# Altium schematic sheet MPU-Peripherals.SchDoc
size C
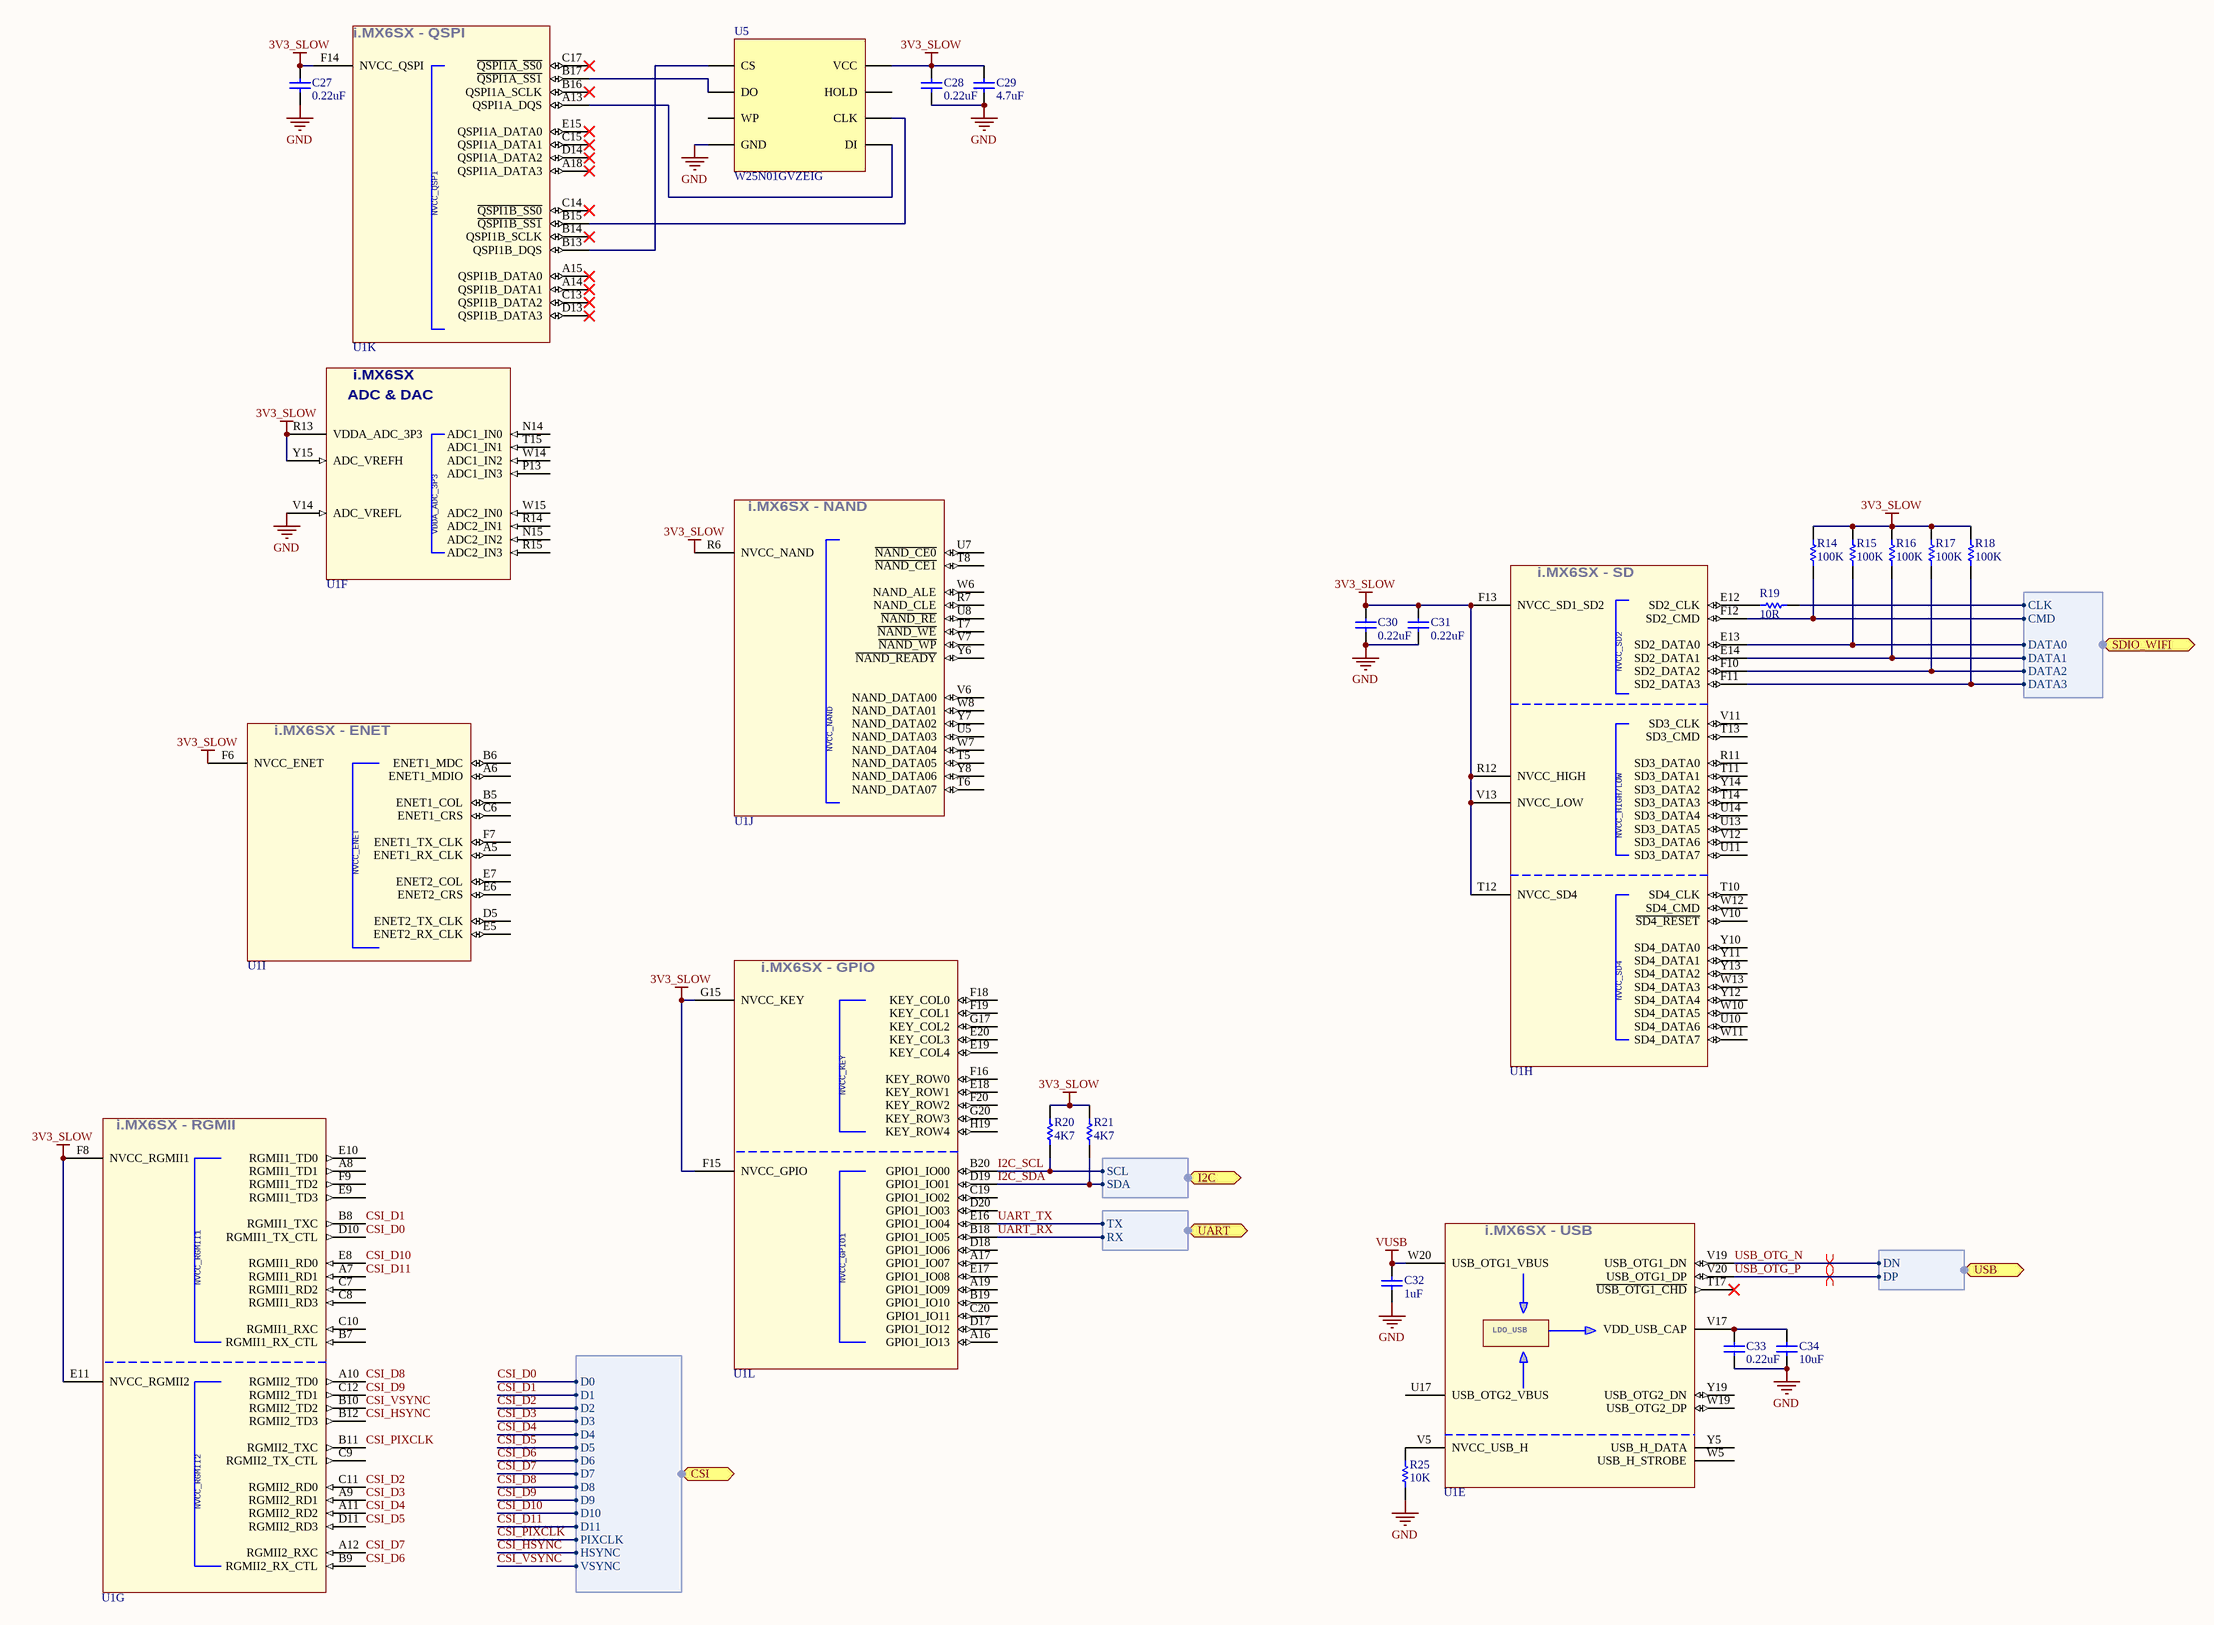
[diagram p0: MPU-Peripherals.SchDoc]

## Parts
C27  value 0.22uF  [C0402[1005X55]]  (hidden comment: 0.22uF 6.3V 0402)
C28  value 0.22uF  [C0402[1005X55]]  (hidden comment: 0.22uF 6.3V 0402)
C29  value 4.7uF  [C0402[1005X55]]  (hidden comment: 4.7uF 6.3V 0402)
C30  value 0.22uF  [C0402[1005X55]]  (hidden comment: 0.22uF 6.3V 0402)
C31  value 0.22uF  [C0402[1005X55]]  (hidden comment: 0.22uF 6.3V 0402)
C32  value 1uF  [C0402[1005X55]]  (hidden comment: 1uF 16V 0402)
C33  value 0.22uF  [C0402[1005X55]]  (hidden comment: 0.22uF 6.3V 0402)
C34  value 10uF  [C0402[1005X55]]  (hidden comment: 10uF 6.3V 0402)
R14  value 100K  [R0402[1005]]  (hidden comment: 100K 1% 0402)
R15  value 100K  [R0402[1005]]  (hidden comment: 100K 1% 0402)
R16  value 100K  [R0402[1005]]  (hidden comment: 100K 1% 0402)
R17  value 100K  [R0402[1005]]  (hidden comment: 100K 1% 0402)
R18  value 100K  [R0402[1005]]  (hidden comment: 100K 1% 0402)
R19  value 10R  [R0402[1005]]  (hidden comment: 10R 1% 0402)
R20  value 4K7  [R0402[1005]]  (hidden comment: 4K7 1% 0402)
R21  value 4K7  [R0402[1005]]  (hidden comment: 4K7 1% 0402)
R25  value 10K  [R0402[1005]]  (hidden comment: 10K 1% 0402)
U1  MCIMX6X3EVO10AB  [BGA-400]  (value not drawn)  (parts E,F,G,H,I,J,K,L of 12)
U5  W25N01GVZEIG  [WSON-8 (6X8MM)]

## Ports
CSI (harness CSI), I2C (harness I2C), SDIO_WIFI (harness SDIO), UART (harness UART), USB (harness USB)

## Harnesses
SDIO: CLK, CMD, DATA0, DATA1, DATA2, DATA3
CSI: D2, D3, D1, D0, D6, D7, D5, D4, D10, D9, D8, PIXCLK, D11, HSYNC, VSYNC
I2C: SCL, SDA
UART: TX, RX
USB: DN, DP

## Nets
3V3_SLOW: C27.2 C28.2 C29.2 C30.2 C31.2 R14.2 R15.2 R16.2 R17.2 R18.2 R20.2 R21.2 U1.E11(NVCC_RGMII2) U1.F6(NVCC_ENET) U1.F8(NVCC_RGMII1) U1.F13(NVCC_SD1_SD2) U1.F14(NVCC_QSPI) U1.F15(NVCC_GPIO) U1.G15(NVCC_KEY) U1.R6(NVCC_NAND) U1.R12(NVCC_HIGH) U1.R13(VDDA_ADC_3P3) U1.T12(NVCC_SD4) U1.V13(NVCC_LOW) U1.Y15(ADC_VREFH) U5.8(VCC)
GND: C27.1 C28.1 C29.1 C30.1 C31.1 C32.1 C33.1 C34.1 R25.1 U1.V14(ADC_VREFL) U5.4(GND)
VUSB: C32.2 U1.W20(USB_OTG1_VBUS)
CSI_D0: U1.D10(RGMII1_TX_CTL) ; port CSI.D0
CSI_D1: U1.B8(RGMII1_TXC) ; port CSI.D1
CSI_D2: U1.C11(RGMII2_RD0) ; port CSI.D2
CSI_D3: U1.A9(RGMII2_RD1) ; port CSI.D3
CSI_D4: U1.A11(RGMII2_RD2) ; port CSI.D4
CSI_D5: U1.D11(RGMII2_RD3) ; port CSI.D5
CSI_D6: U1.B9(RGMII2_RX_CTL) ; port CSI.D6
CSI_D7: U1.A12(RGMII2_RXC) ; port CSI.D7
CSI_D8: U1.A10(RGMII2_TD0) ; port CSI.D8
CSI_D9: U1.C12(RGMII2_TD1) ; port CSI.D9
CSI_D10: U1.E8(RGMII1_RD0) ; port CSI.D10
CSI_D11: U1.A7(RGMII1_RD1) ; port CSI.D11
CSI_HSYNC: U1.B12(RGMII2_TD3) ; port CSI.HSYNC
CSI_PIXCLK: U1.B11(RGMII2_TXC) ; port CSI.PIXCLK
CSI_VSYNC: U1.B10(RGMII2_TD2) ; port CSI.VSYNC
I2C_SCL: R20.1 U1.B20(GPIO1_IO00) ; port I2C.SCL
I2C_SDA: R21.1 U1.D19(GPIO1_IO01) ; port I2C.SDA
UART_RX: U1.B18(GPIO1_IO05) ; port UART.RX
UART_TX: U1.E16(GPIO1_IO04) ; port UART.TX
USB_OTG_N: U1.V19(USB_OTG1_DN) ; port USB.DN
USB_OTG_P: U1.V20(USB_OTG1_DP) ; port USB.DP
NetC33_2: C33.2 C34.2 U1.V17(VDD_USB_CAP)
NetR14_1: R14.1 U1.F12(SD2_CMD) ; port SDIO_WIFI.CMD
NetR15_1: R15.1 U1.E13(SD2_DATA0) ; port SDIO_WIFI.DATA0
NetR16_1: R16.1 U1.E14(SD2_DATA1) ; port SDIO_WIFI.DATA1
NetR17_1: R17.1 U1.F10(SD2_DATA2) ; port SDIO_WIFI.DATA2
NetR18_1: R18.1 U1.F11(SD2_DATA3) ; port SDIO_WIFI.DATA3
NetR19_1: R19.1 U1.E12(SD2_CLK)
NetR19_2: R19.2 ; port SDIO_WIFI.CLK
NetR25_2: R25.2 U1.V5(NVCC_USB_H)
NetU1_A13: U1.A13(QSPI1A_DQS) U5.5(DI)
NetU1_B13: U1.B13(QSPI1B_DQS) U5.1(CS)
NetU1_B15: U1.B15(~{QSPI1B_SS1}) U5.6(CLK)
NetU1_B17: U1.B17(~{QSPI1A_SS1}) U5.2(DO)

Not connected (* = marked no-connect by the designer): U1 A5(ENET1_RX_CLK) A6(ENET1_MDIO) A8(RGMII1_TD1) A14(QSPI1B_DATA1)* A15(QSPI1B_DATA0)* A16(GPIO1_IO13) A17(GPIO1_IO07) A18(QSPI1A_DATA3)* A19(GPIO1_IO09) B5(ENET1_COL) B6(ENET1_MDC) B7(RGMII1_RX_CTL) B14(QSPI1B_SCLK)* B16(QSPI1A_SCLK)* B19(GPIO1_IO10) C6(ENET1_CRS) C7(RGMII1_RD2) C8(RGMII1_RD3) C9(RGMII2_TX_CTL) C10(RGMII1_RXC) C13(QSPI1B_DATA2)* C14(~{QSPI1B_SS0})* C15(QSPI1A_DATA1)* C17(~{QSPI1A}_~{SS0})* C19(GPIO1_IO02) C20(GPIO1_IO11) D5(ENET2_TX_CLK) D13(QSPI1B_DATA3)* D14(QSPI1A_DATA2)* D17(GPIO1_IO12) D18(GPIO1_IO06) D20(GPIO1_IO03) E5(ENET2_RX_CLK) E6(ENET2_CRS) E7(ENET2_COL) E9(RGMII1_TD3) E10(RGMII1_TD0) E15(QSPI1A_DATA0)* E17(GPIO1_IO08) E18(KEY_ROW1) E19(KEY_COL4) E20(KEY_COL3) F7(ENET1_TX_CLK) F9(RGMII1_TD2) F16(KEY_ROW0) F18(KEY_COL0) F19(KEY_COL1) F20(KEY_ROW2) G17(KEY_COL2) G20(KEY_ROW3) H19(KEY_ROW4) N14(ADC1_IN0) N15(ADC2_IN2) P13(ADC1_IN3) R7(NAND_CLE) R11(SD3_DATA0) R14(ADC2_IN1) R15(ADC2_IN3) T5(NAND_DATA05) T6(NAND_DATA07) T7(~{NAND_WE}) T8(~{NAND_CE1}) T10(SD4_CLK) T11(SD3_DATA1) T13(SD3_CMD) T14(SD3_DATA3) T15(ADC1_IN1) T17(~{USB_OTG1_CHD})* U5(NAND_DATA03) U7(~{NAND_CE0}) U8(~{NAND_RE}) U10(SD4_DATA6) U11(SD3_DATA7) U13(SD3_DATA5) U14(SD3_DATA4) U17(USB_OTG2_VBUS) V6(NAND_DATA00) V7(~{NAND_WP}) V10(~{SD4_RESET}) V11(SD3_CLK) V12(SD3_DATA6) W5(USB_H_STROBE) W6(NAND_ALE) W7(NAND_DATA04) W8(NAND_DATA01) W10(SD4_DATA5) W11(SD4_DATA7) W12(SD4_CMD) W13(SD4_DATA3) W14(ADC1_IN2) W15(ADC2_IN0) W19(USB_OTG2_DP) Y5(USB_H_DATA) Y6(~{NAND_READY}) Y7(NAND_DATA02) Y8(NAND_DATA06) Y10(SD4_DATA0) Y11(SD4_DATA1) Y12(SD4_DATA4) Y13(SD4_DATA2) Y14(SD3_DATA2) Y19(USB_OTG2_DN); U5 3(WP) 7(HOLD)

## Layout directives
differential pair: USB_OTG_N, USB_OTG_P

## Notes on the sheet
- (in symbol MCIMX6X3EVO10AB, part E) i.MX6SX - USB; LDO_USB
- (in symbol MCIMX6X3EVO10AB, part F) i.MX6SX; ADC & DAC
- (in symbol MCIMX6X3EVO10AB, part G) i.MX6SX - RGMII
- (in symbol MCIMX6X3EVO10AB, part H) i.MX6SX - SD; NVCC_SD2; NVCC_HIGH/LOW
- (in symbol MCIMX6X3EVO10AB, part I) i.MX6SX - ENET
- (in symbol MCIMX6X3EVO10AB, part J) i.MX6SX - NAND
- (in symbol MCIMX6X3EVO10AB, part K) i.MX6SX - QSPI
- (in symbol MCIMX6X3EVO10AB, part L) i.MX6SX - GPIO; NVCC_GPIO1

## Library data of the parts
C27 C28 C30 C31 C33 = CAP_0.22uF_6.3V_0402_10%: 0.22uF 6.3V 10% 0402 (1005 Metric); PartNumber: JMK105BJ224KV-F; Manufacturer: Taiyo Yuden; Mounting Technology: Surface Mount; PackageReference: 0402; PackageDescription: 0402 (1005 Metric); Voltage: 6.3V; Tolerance: 10%
C29 = CAP_4.7uF_6.3V_0402_20%: 4.7uF 6.3V 20% 0402 (1005 Metric); PartNumber: GRM155R60J475ME47D; Manufacturer: Murata; Mounting Technology: Surface Mount; PackageReference: 0402; PackageDescription: 0402 (1005 Metric); Voltage: 6.3V; Tolerance: 20%
C32 = CAP_1uF_16V_0402_10%: 1uF 16V 10% 0402 (1005 Metric); PartNumber: GRM155R61C105KE01D; Manufacturer: Murata; Mounting Technology: Surface Mount; PackageReference: 0402; PackageDescription: 0402 (1005 Metric); Voltage: 16V; Tolerance: 10%
C34 = CAP_10uF_6.3V_0402_20%: 10uF 6.3V 20% 0402 (1005 Metric); PartNumber: GRM155R60J106ME44D; Manufacturer: Murata; Mounting Technology: Surface Mount; PackageReference: 0402; PackageDescription: 0402 (1005 Metric); Voltage: 6.3V; Tolerance: 20%
R14-R18 = RES_100K_0402_1%: 100K 0.063W 1% 0402 (1005 Metric); Manufacturer: KOA Speer; PartNumber: RK73H1ETTP1003F; Tolerance: 1%; Power: 0.063W; Mounting Technology: Surface Mount; PackageReference: 0402; PackageDescription: 0402 (1005 Metric); ComponentLink1Description: Datasheet; ComponentLink1URL: http://www.koaspeer.com/catimages/Products/RK73H/RK73H.pdf
R19 = RES_10R_0402_1%: 10R 0.063W 1% 0402 (1005 Metric); Manufacturer: KOA Speer; PartNumber: RK73H1ETTP10R0F; Tolerance: 1%; Power: 0.063W; Mounting Technology: Surface Mount; PackageReference: 0402; PackageDescription: 0402 (1005 Metric); ComponentLink1Description: Datasheet; ComponentLink1URL: http://www.koaspeer.com/catimages/Products/RK73H/RK73H.pdf
R20 R21 = RES_4K7_0402_1%: 4K7 0.063W 1% 0402 (1005 Metric); Manufacturer: KOA Speer; PartNumber: RK73H1ETTP4701F; Tolerance: 1%; Power: 0.063W; Mounting Technology: Surface Mount; PackageReference: 0402; PackageDescription: 0402 (1005 Metric); ComponentLink1Description: Datasheet; ComponentLink1URL: http://www.koaspeer.com/catimages/Products/RK73H/RK73H.pdf
R25 = RES_10K_0402_1%: 10K 0.063W 1% 0402 (1005 Metric); Manufacturer: KOA Speer; PartNumber: RK73H1ETTP1002F; Tolerance: 1%; Power: 0.063W; Mounting Technology: Surface Mount; PackageReference: 0402; PackageDescription: 0402 (1005 Metric); ComponentLink1Description: Datasheet; ComponentLink1URL: http://www.koaspeer.com/catimages/Products/RK73H/RK73H.pdf
U1 = MCIMX6X3EVO10AB: IC MPU I.MX6SX 1GHZ 400MAPBGA; Manufacturer: NXP; PartNumber: MCIMX6X3EVO10AB; Mounting Technology: Surface Mount; PackageReference: BGA-400
U5 = W25N01GVZEIG: pin to pad: 4>4+9; Manufacturer: Winbond Electronics; PartNumber: W25N01GVZEIG; Mounting Technology: Surface Mount; PackageReference: WSON-8